# Altium schematic sheet HorizBallCounter.SchDoc: Horizontal Ball Counter
size A4; SheetNumber: 4
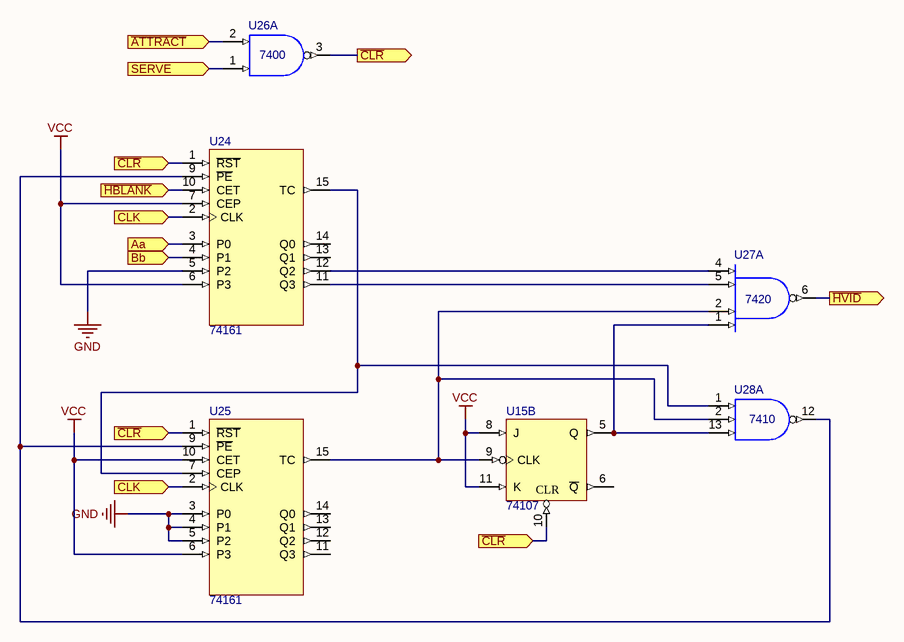
[diagram p0: HorizBallCounter.SchDoc]

## Parts
U15  74107  [N014]  (part B of 2)
U24  74161  [N016]
U25  74161  [N016]
U26  7400  [N014]  (part A of 4)
U27  7420  [N014]  (part A of 2)
U28  7410  [N014]  (part A of 3)

## Ports
Aa, Bb, CLK, SERVE, ~{ATTRACT}, ~{CLR}, ~{HBLANK}, ~{HVID}

## Nets
GND: U15.7(GND) U24.5(P2) U24.8(GND) U25.3(P0) U25.4(P1) U25.5(P2) U25.8(GND) U26.7(GND) U27.7(GND) U28.7(GND)
VCC: U15.8(J) U15.11(K) U15.14(VCC) U24.6(P3) U24.7(CEP) U24.16(VCC) U25.6(P3) U25.10(CET) U25.16(VCC) U26.14(VCC) U27.14(VCC) U28.14(VCC)
~{ATTRACT}: U26.2(B) ; port ~{ATTRACT}
~{CLR}: U15.10(CLR) U24.1(~{RST}) U25.1(~{RST}) U26.3(Y) ; port ~{CLR}
~{HBLANK}: U24.10(CET) ; port ~{HBLANK}
~{HVID}: U27.6(Y) ; port ~{HVID}
Aa: U24.3(P0) ; port Aa
Bb: U24.4(P1) ; port Bb
CLK: U24.2(CLK) U25.2(CLK) ; port CLK
SERVE: U26.1(A) ; port SERVE
NetU15_5: U15.5(Q) U27.1(A) U28.13(C)
NetU15_9: U15.9(CLK) U25.15(TC) U27.2(B) U28.2(B)
NetU24_9: U24.9(~{PE}) U25.9(~{PE}) U28.12(Y)
NetU24_11: U24.11(Q3) U27.5(D)
NetU24_12: U24.12(Q2) U27.4(C)
NetU24_15: U24.15(TC) U25.7(CEP) U28.1(A)

Not connected (* = marked no-connect by the designer): U15 6(~{Q}); U24 13(Q1) 14(Q0); U25 11(Q3) 12(Q2) 13(Q1) 14(Q0)

## Notes on the sheet
- Text
- Page
- PONG

## Library data of the parts
U15 = SN74LS107AN: Dual J-K Flip-Flop with Clear; Published: 8-Jun-2000; LatestRevisionDate: 04-Mar-2005; LatestRevisionNote: Stylized 3D Model Added.; DatasheetVersion: Mar-1988; PackageVersion: Oct-1995; PackageReference: N014; Publisher: Altium Limited; PackageDescription: DIP; 14 Leads; Row Spacing 7.62 mm; Pitch 2.54 mm; ComponentLink1Description: Manufacturer Link; ComponentLink1URL: http://www.ti.com/; ComponentLink2Description: Datasheet; ComponentLink2URL: http://www-s.ti.com/sc/ds/sn74ls107a.pdf
U24 U25 = SN74LS161AN: Synchronous 4-Bit Counter; Published: 8-Jun-2000; LatestRevisionDate: 04-Mar-2005; LatestRevisionNote: Stylized 3D Model Added.; DatasheetVersion: Mar-1988; PackageVersion: Oct-1995; PackageReference: N016; Publisher: Altium Limited; PackageDescription: DIP; 16 Leads; Row Spacing 7.62 mm; Pitch 2.54 mm; Code_JEDEC: MS-001-BB; ComponentLink1Description: Manufacturer Link; ComponentLink1URL: http://www.ti.com/; ComponentLink2Description: Datasheet; ComponentLink2URL: http://www-s.ti.com/sc/ds/sn74ls161a.pdf; ComponentLink3Description: URL Link1; ComponentLink3URL: http://focus.ti.com/docs/prod/folders/print/sn74ls161a.html
U26 = SN74LS00N: Quadruple 2-Input Positive-NAND Gate; Published: 8-Jun-2000; LatestRevisionDate: 04-Mar-2005; LatestRevisionNote: Stylized 3D Model Added.; DatasheetVersion: Mar-1988; PackageVersion: Oct-1995; PackageReference: N014; Publisher: Altium Limited; PackageDescription: DIP; 14 Leads; Row Spacing 7.62 mm; Pitch 2.54 mm; ComponentLink1Description: Manufacturer Link; ComponentLink1URL: http://www.ti.com/; ComponentLink2Description: Datasheet; ComponentLink2URL: http://www-s.ti.com/sc/ds/sn74ls00.pdf
U27 = SN74LS20N: Dual 4-Input Positive-NAND Gate; Note: Pins 3 and 11 are NC & not drawn.; Published: 8-Jun-2000; LatestRevisionDate: 04-Mar-2005; LatestRevisionNote: Stylized 3D Model Added.; DatasheetVersion: Mar-1988; PackageVersion: Oct-1995; PackageReference: N014; Publisher: Altium Limited; PackageDescription: DIP; 14 Leads; Row Spacing 7.62 mm; Pitch 2.54 mm; ComponentLink1Description: Manufacturer Link; ComponentLink1URL: http://www.ti.com/; ComponentLink2Description: Datasheet; ComponentLink2URL: http://www-s.ti.com/sc/ds/sn74ls20.pdf
U28 = SN74LS10N: Triple 3-Input Positive-NAND Gate; Published: 8-Jun-2000; LatestRevisionDate: 04-Mar-2005; LatestRevisionNote: Stylized 3D Model Added.; DatasheetVersion: Mar-1988; PackageVersion: Oct-1995; PackageReference: N014; Publisher: Altium Limited; PackageDescription: DIP; 14 Leads; Row Spacing 7.62 mm; Pitch 2.54 mm; ComponentLink1Description: Manufacturer Link; ComponentLink1URL: http://www.ti.com/; ComponentLink2Description: Datasheet; ComponentLink2URL: http://www-s.ti.com/sc/ds/sn74ls10.pdf